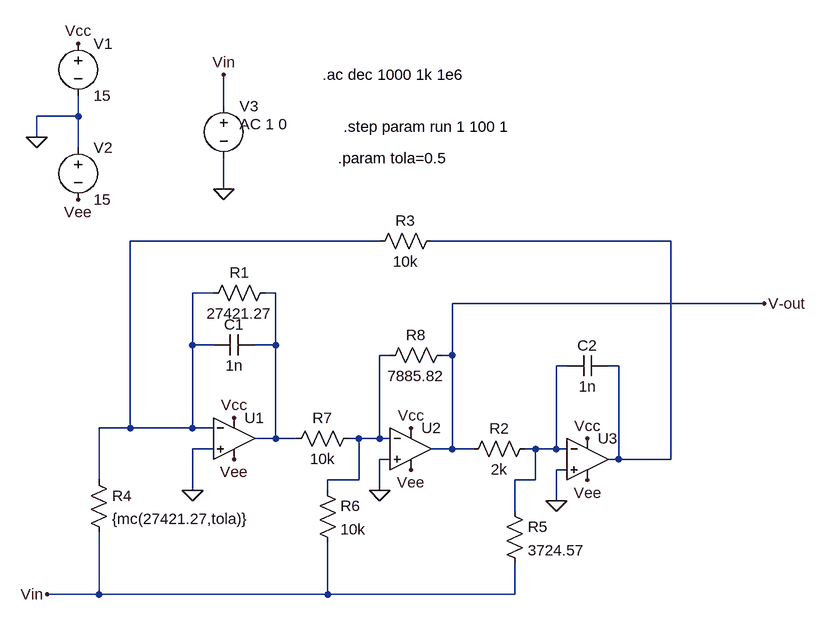
[diagram p0: schematic Fleischer-Tow.asc]
Fleischer-Tow.asc, the LTspice schematic file:
Version 4
SHEET 1 880 680
WIRE -80 -400 -80 -448
WIRE -304 -384 -304 -416
WIRE -304 -384 -368 -384
WIRE -368 -352 -368 -384
WIRE -304 -336 -304 -384
WIRE -80 -272 -80 -320
WIRE 160 -192 -224 -192
WIRE 608 -192 240 -192
WIRE -96 -112 -128 -112
WIRE 0 -112 -16 -112
WIRE 752 -96 272 -96
WIRE -128 -32 -128 -112
WIRE -96 -32 -128 -32
WIRE 0 -32 0 -112
WIRE 0 -32 -32 -32
WIRE 176 -16 160 -16
WIRE 272 -16 272 -96
WIRE 272 -16 256 -16
WIRE 448 0 432 0
WIRE 528 0 512 0
WIRE -224 96 -224 -192
WIRE -224 96 -272 96
WIRE -128 96 -128 -32
WIRE -128 96 -224 96
WIRE -96 96 -128 96
WIRE 0 112 0 -32
WIRE 0 112 -32 112
WIRE 32 112 0 112
WIRE 128 112 112 112
WIRE 160 112 160 -16
WIRE 160 112 128 112
WIRE 176 112 160 112
WIRE -96 128 -128 128
WIRE 272 128 272 -16
WIRE 272 128 240 128
WIRE 304 128 272 128
WIRE 400 128 384 128
WIRE 432 128 432 0
WIRE 432 128 400 128
WIRE 448 128 432 128
WIRE 176 144 160 144
WIRE 528 144 528 0
WIRE 528 144 512 144
WIRE 608 144 608 -192
WIRE 608 144 528 144
WIRE 448 160 432 160
WIRE -272 176 -272 96
WIRE 128 176 128 112
WIRE 128 176 80 176
WIRE 400 176 400 128
WIRE 400 176 368 176
WIRE -128 192 -128 128
WIRE 80 192 80 176
WIRE 160 192 160 144
WIRE 432 208 432 160
WIRE 368 224 368 176
WIRE -272 352 -272 256
WIRE -272 352 -352 352
WIRE 80 352 80 272
WIRE 80 352 -272 352
WIRE 368 352 368 304
WIRE 368 352 80 352
FLAG 432 208 0
FLAG 160 192 0
FLAG 752 -96 V-out
FLAG -64 80 Vcc
FLAG 208 96 Vcc
FLAG 480 112 Vcc
FLAG -64 144 Vee
FLAG 208 160 Vee
FLAG 480 176 Vee
FLAG -304 -496 Vcc
FLAG -304 -256 Vee
FLAG -368 -352 0
FLAG -80 -272 0
FLAG -80 -448 Vin
FLAG -128 192 0
FLAG -352 352 Vin
SYMBOL Opamps\\UniversalOpamp2 -64 112 R0
SYMATTR InstName U1
SYMATTR Value2 Avol=1000Meg GBW=10000Meg Slew=1000Meg
SYMATTR SpiceLine ilimit=50 rail=0 Vos=0 phimargin=45
SYMATTR SpiceLine2 en=0 enk=0 in=0 ink=0 Rin=100000Meg
SYMBOL Opamps\\UniversalOpamp2 208 128 R0
SYMATTR InstName U2
SYMATTR Value2 Avol=1000Meg GBW=10000Meg Slew=1000Meg
SYMATTR SpiceLine ilimit=50 rail=0 Vos=0 phimargin=45
SYMATTR SpiceLine2 en=0 enk=0 in=0 ink=0 Rin=100000Meg
SYMBOL Opamps\\UniversalOpamp2 480 144 R0
SYMATTR InstName U3
SYMATTR Value2 Avol=1000Meg GBW=10000Meg Slew=1000Meg
SYMATTR SpiceLine ilimit=50 rail=0 Vos=0 phimargin=45
SYMATTR SpiceLine2 en=0 enk=0 in=0 ink=0 Rin=100000Meg
SYMBOL res 0 -128 R90
WINDOW 0 0 56 VBottom 2
WINDOW 3 32 56 VTop 2
SYMATTR InstName R1
SYMATTR Value 27421.27
SYMBOL res 128 96 R90
WINDOW 0 0 56 VBottom 2
WINDOW 3 32 56 VTop 2
SYMATTR InstName R7
SYMATTR Value 10k
SYMBOL res 400 112 R90
WINDOW 0 0 56 VBottom 2
WINDOW 3 32 56 VTop 2
SYMATTR InstName R2
SYMATTR Value 2k
SYMBOL voltage -304 -512 R0
WINDOW 123 0 0 Left 2
WINDOW 39 0 0 Left 2
SYMATTR InstName V1
SYMATTR Value 15
SYMBOL voltage -304 -352 R0
WINDOW 123 0 0 Left 2
WINDOW 39 0 0 Left 2
SYMATTR InstName V2
SYMATTR Value 15
SYMBOL voltage -80 -416 R0
WINDOW 123 24 44 Left 2
WINDOW 39 0 0 Left 2
SYMATTR Value2 AC 1 0
SYMATTR InstName V3
SYMATTR Value ""
SYMBOL cap -32 -48 R90
WINDOW 0 0 32 VBottom 2
WINDOW 3 32 32 VTop 2
SYMATTR InstName C1
SYMATTR Value 1n
SYMBOL res 256 -208 R90
WINDOW 0 0 56 VBottom 2
WINDOW 3 32 56 VTop 2
SYMATTR InstName R3
SYMATTR Value 10k
SYMBOL res 272 -32 R90
WINDOW 0 0 56 VBottom 2
WINDOW 3 32 56 VTop 2
SYMATTR InstName R8
SYMATTR Value 7885.82
SYMBOL cap 512 -16 R90
WINDOW 0 0 32 VBottom 2
WINDOW 3 32 32 VTop 2
SYMATTR InstName C2
SYMATTR Value 1n
SYMBOL res -288 160 R0
SYMATTR InstName R4
SYMATTR Value {mc(27421.27,tola)}
SYMBOL res 64 176 R0
SYMATTR InstName R6
SYMATTR Value 10k
SYMBOL res 352 208 R0
SYMATTR InstName R5
SYMATTR Value 3724.57
TEXT 72 -448 Left 2 !.ac dec 1000 1k 1e6
TEXT 104 -368 Left 2 !.step param run 1 100 1
TEXT 96 -320 Left 2 !.param tola=0.5

The netlist it stands for:
* Fleischer-Tow.asc
XU1 0 N001 Vcc Vee N003 level.2 Avol=1000Meg GBW=10000Meg Slew=1000Meg ilimit=50 rail=0 Vos=0 phimargin=45 en=0 enk=0 in=0 ink=0 Rin=100000Meg  ; pins IN+ IN- V+ V- OUT
XU2 0 N004 Vcc Vee V-out level.2 Avol=1000Meg GBW=10000Meg Slew=1000Meg ilimit=50 rail=0 Vos=0 phimargin=45 en=0 enk=0 in=0 ink=0 Rin=100000Meg  ; pins IN+ IN- V+ V- OUT
XU3 0 N005 Vcc Vee N002 level.2 Avol=1000Meg GBW=10000Meg Slew=1000Meg ilimit=50 rail=0 Vos=0 phimargin=45 en=0 enk=0 in=0 ink=0 Rin=100000Meg  ; pins IN+ IN- V+ V- OUT
R1 N003 N001 27421.27
R7 N004 N003 10k
R2 N005 V-out 2k
V1 Vcc 0 15
V2 0 Vee 15
V3 Vin 0 AC 1 0
C1 N003 N001 1n
R3 N002 N001 10k
R8 V-out N004 7885.82
C2 N002 N005 1n
R4 N001 Vin {mc(27421.27,tola)}
R6 N004 Vin 10k
R5 N005 Vin 3724.57
.ac dec 1000 1k 1e6
.step param run 1 100 1
.param tola=0.5
.lib UniversalOpamps2.sub
.backanno
.end